# EAGLE design Mighty_GCD (EAGLE 6.3)
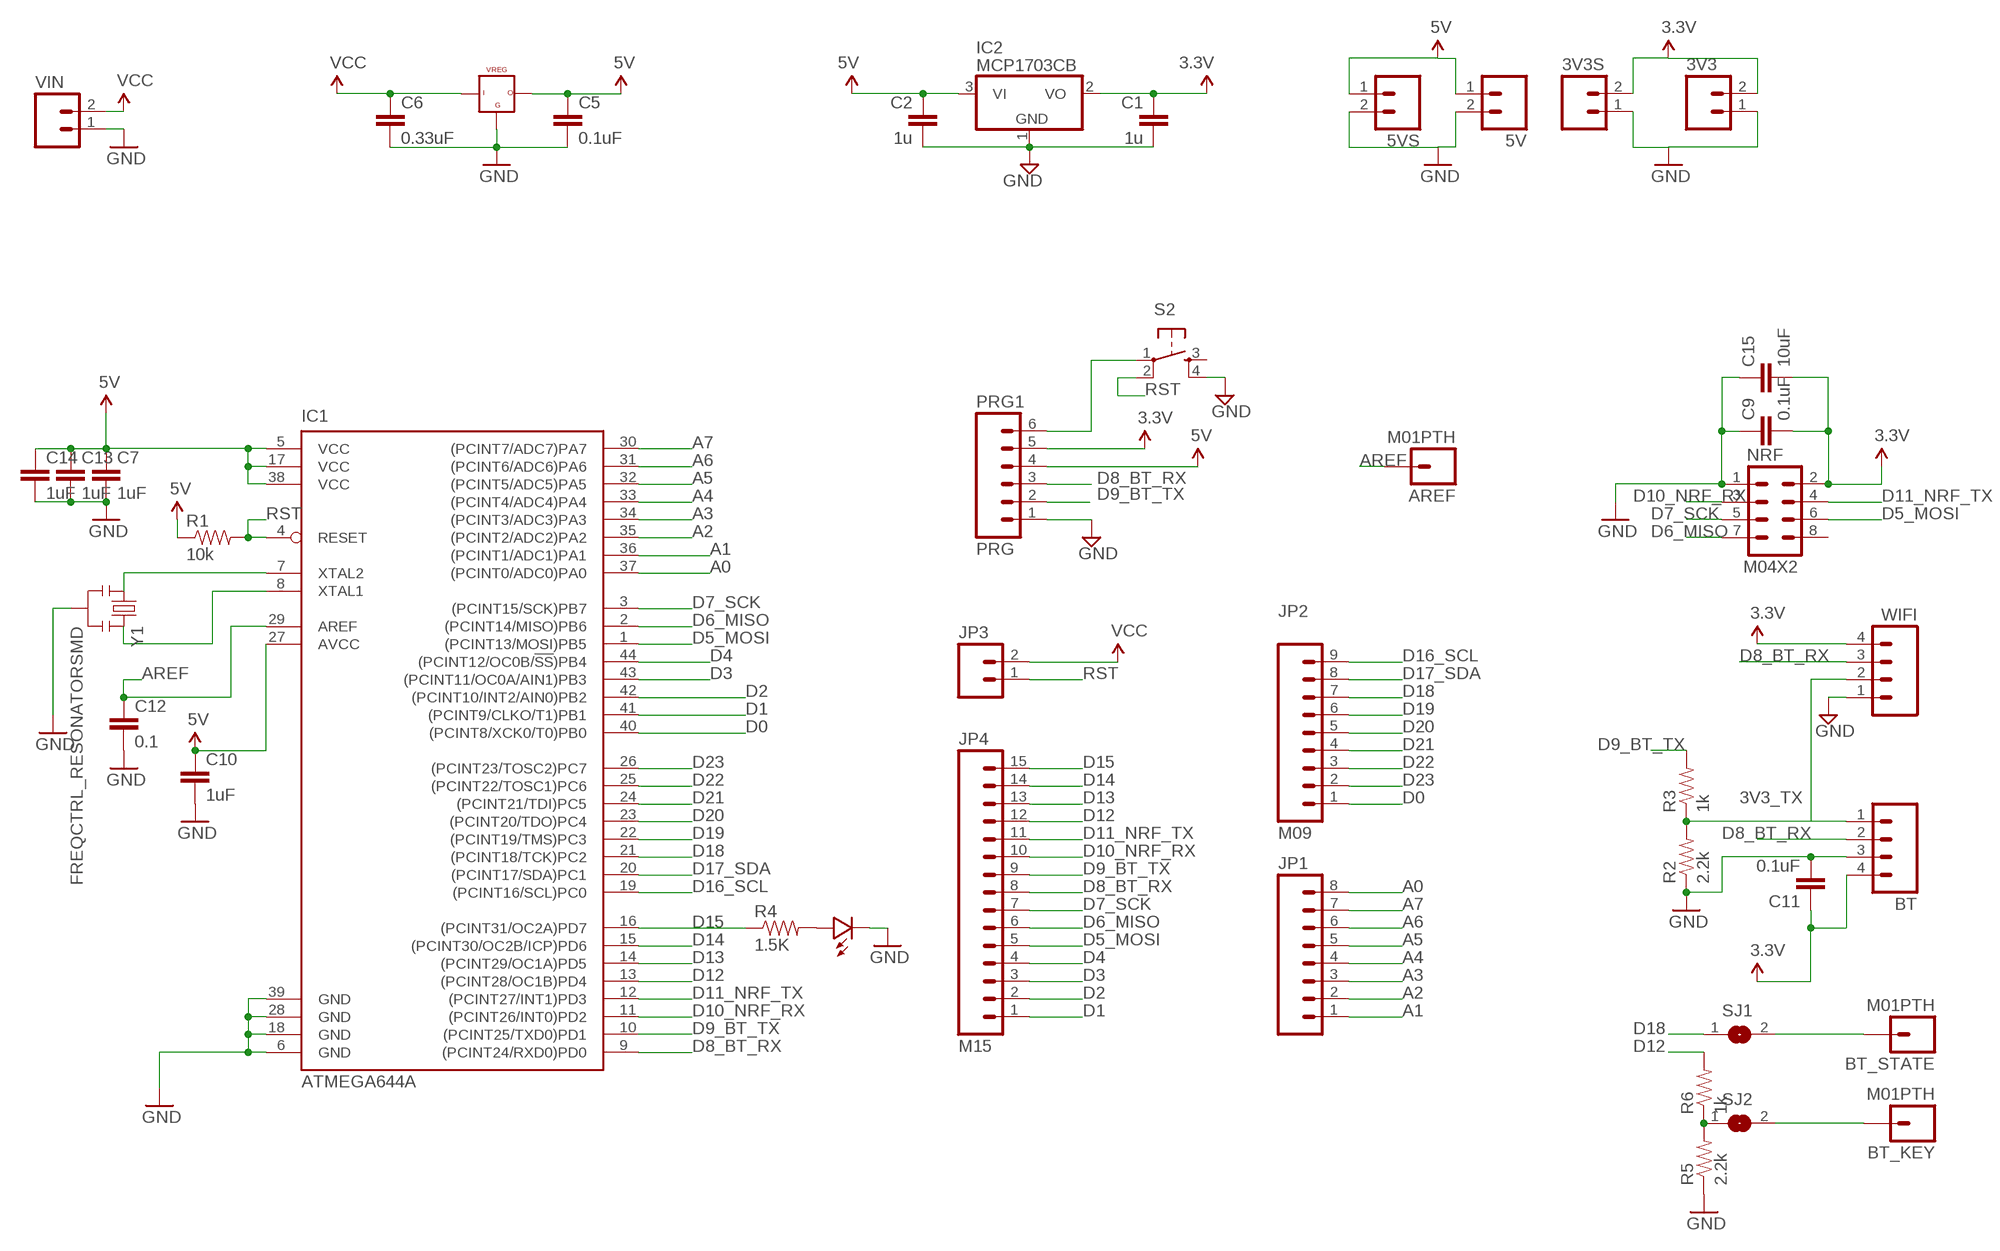
[diagram p0: schematic, sheet 1]

## Parts
3V3  M02PTH  [1X02]
3V3S  M02PTH  [1X02]
5V  M02PTH  [1X02]
5VS  M02PTH  [1X02]
AREF  M01PTH  [1X01]
BT  M04PTH  [1X04]
BT_KEY  M01PTH  [1X01]
BT_STATE  M01PTH  [1X01]
C1  1u  CAP0805  [0805]
C2  1u  CAP0805  [0805]
C5  0.1uF  CAP0805  [0805]
C6  0.33uF  CAP0805  [0805]
C7  1uF  CAP0805  [0805]
C9  0.1uF  CAP0805  [0805]
C10  1uF  CAP0805  [0805]
C11  0.1uF  CAP0805  [0805]
C12  0.1  CAP0805  [0805]
C13  1uF  CAP0805  [0805]
C14  1uF  CAP0805  [0805]
C15  10uF  CAP0805  [0805]
IC1  ATMEGA644A  [TQFP44]
IC2  MCP1703CB  [SOT23]
JP1  M081X08  [1X08]
JP2  M09  [1X09]
JP3  M02PTH  [1X02]
JP4  M15  [1X15]
NRF  M04X2  [2X4]
PRG1  PRG  M06SIP  [1X06]
R1  10k  RESISTOR0805-RES  [0805]
R2  2.2k  RESISTOR0805-RES  [0805]
R3  1k  RESISTOR0805-RES  [0805]
R4  1.5K  RESISTOR0805-RES  [0805]
R5  2.2k  RESISTOR0805-RES  [0805]
R6  1k  RESISTOR0805-RES  [0805]
S2  TAC_SWITCHSMD  [TACTILE_SWITCH_SMD]
SJ1  SJ  [SJ]
SJ2  SJ  [SJ]
U$5  VREG_5V  [DPACK]
U$14  LED0805  [0805-LED]
VIN  M02PTH  [1X02]
WIFI  M04PTH  [1X04]
Y1  FREQCTRL_RESONATORSMD  [FREQCTRL_RESONATOR-SMD]

## Nets
3.3V: 3V3.2 3V3S.2 BT.4 C1.1 C9.2 C11.1 C15.2 IC2.2(VO) NRF.2 PRG1.5 WIFI.4
3V3_TX: BT.1 R2.2 R3.1 WIFI.2
5V: 5V.1 5VS.1 C2.1 C5.1 C7.1 C10.1 C13.1 C14.1 IC1.5(VCC) IC1.17(VCC) IC1.27(AVCC) IC1.38(VCC) IC2.3(VI) PRG1.4 R1.1 U$5.3
A0: IC1.37((PCINT0/ADC0)PA0) JP1.8
A1: IC1.36((PCINT1/ADC1)PA1) JP1.1
A2: IC1.35((PCINT2/ADC2)PA2) JP1.2
A3: IC1.34((PCINT3/ADC3)PA3) JP1.3
A4: IC1.33((PCINT4/ADC4)PA4) JP1.4
A5: IC1.32((PCINT5/ADC5)PA5) JP1.5
A6: IC1.31((PCINT6/ADC6)PA6) JP1.6
A7: IC1.30((PCINT7/ADC7)PA7) JP1.7
AREF: AREF.1 C12.1 IC1.29(AREF)
D0: IC1.40((PCINT8/XCK0/T0)PB0) JP2.1
D1: IC1.41((PCINT9/CLKO/T1)PB1) JP4.1
D2: IC1.42((PCINT10/INT2/AIN0)PB2) JP4.2
D3: IC1.43((PCINT11/OC0A/AIN1)PB3) JP4.3
D4: IC1.44((PCINT12/OC0B/!SS!)PB4) JP4.4
D5_MOSI: IC1.1((PCINT13/MOSI)PB5) JP4.5 NRF.6
D6_MISO: IC1.2((PCINT14/MISO)PB6) JP4.6 NRF.7
D7_SCK: IC1.3((PCINT15/SCK)PB7) JP4.7 NRF.5
D8_BT_RX: BT.2 IC1.9((PCINT24/RXD0)PD0) JP4.8 PRG1.3 WIFI.3
D9_BT_TX: IC1.10((PCINT25/TXD0)PD1) JP4.9 PRG1.2 R3.2
D10_NRF_RX: IC1.11((PCINT26/INT0)PD2) JP4.10 NRF.3
D11_NRF_TX: IC1.12((PCINT27/INT1)PD3) JP4.11 NRF.4
D12: IC1.13((PCINT28/OC1B)PD4) JP4.12 R6.2
D13: IC1.14((PCINT29/OC1A)PD5) JP4.13
D14: IC1.15((PCINT30/OC2B/ICP)PD6) JP4.14
D15: IC1.16((PCINT31/OC2A)PD7) JP4.15 R4.1
D16_SCL: IC1.19((PCINT16/SCL)PC0) JP2.9
D17_SDA: IC1.20((PCINT17/SDA)PC1) JP2.8
D18: IC1.21((PCINT18/TCK)PC2) JP2.7 SJ1.1
D19: IC1.22((PCINT19/TMS)PC3) JP2.6
D20: IC1.23((PCINT20/TDO)PC4) JP2.5
D21: IC1.24((PCINT21/TDI)PC5) JP2.4
D22: IC1.25((PCINT22/TOSC1)PC6) JP2.3
D23: IC1.26((PCINT23/TOSC2)PC7) JP2.2
GND: 3V3.1 3V3S.1 5V.2 5VS.2 BT.3 C1.2 C2.2 C5.2 C6.2 C7.2 C9.1 C10.2 C11.2 C12.2 C13.2 C14.2 C15.1 IC1.6(GND) IC1.18(GND) IC1.28(GND) IC1.39(GND) IC2.1(GND) NRF.1 PRG1.1 R2.1 R5.1 S2.4 U$5.2 U$14.MINUS VIN.1 WIFI.1 Y1.2
N$1: R4.2 U$14.PLUS
N$2: IC1.7(XTAL2) Y1.1
N$3: IC1.8(XTAL1) Y1.3
N$4: PRG1.6 S2.1
N$5: BT_STATE.1 SJ1.2
N$6: BT_KEY.1 SJ2.2
N$7: R5.2 R6.1 SJ2.1
RST: IC1.4(RESET) JP3.1 R1.2 S2.2
VCC: C6.1 JP3.2 U$5.1 VIN.2
Unconnected: NRF.8 S2.3

## Library data of the parts
3V3 3V3S 5V 5VS JP3 VIN = SparkFun-Connectors:M02: Header 2 Standard 2-pin 0.1" header. Use with straight break away headers (SKU : PRT-00116), right angle break away headers (PRT-00553), swiss pins (PRT-00743), machine pins (PRT-00117), and female headers (PRT-00115). Molex polarized connector foot print use with SKU : PRT-08233 with associated crimp pins and housings.
AREF BT_KEY BT_STATE = SparkFun-Connectors:M01: Header 1 Standard 1-pin 0.1" header. Use with straight break away headers (SKU : PRT-00116), right angle break away headers (PRT-00553), swiss pins (PRT-00743), machine pins (PRT-00117), and female headers (PRT-00115).
BT WIFI = SparkFun-Connectors:M04: Header 4 Standard 4-pin 0.1" header. Use with straight break away headers (SKU : PRT-00116), right angle break away headers (PRT-00553), swiss pins (PRT-00743), machine pins (PRT-00117), and female headers (PRT-00115). Molex polarized connector foot print use with SKU : PRT-08231 with associated crimp pins and housings. 1MM SMD Version SKU: PRT-10208
C1 C2 C12 = LowPowerLab:CAP: Capacitor Standard 0603 ceramic capacitor, and 0.1" leaded capacitor.
C5-C7 C9-C11 C13-C15 = SparkFun-Capacitors:CAP: Capacitor Standard 0603 ceramic capacitor, and 0.1" leaded capacitor.
IC1 = atmel:ATMEGA644: 8-bit Microcontroller with 64K Bytes In-System Programmable Flash Source: http://www.atmel.com/dyn/resources/prod_documents/doc2593.pdf; MPN: ATMEGA644PV-10AU; OC_FARNELL: 1455123; OC_NEWARK: 58M3748
IC2 = linear:MCP1703: 250 mA, 16V, Low Quiescent Current LDO Regulator Source: http://ww1.microchip.com/downloads/en/DeviceDoc/22049b.pdf
JP1 = SparkFun-Connectors:M08: Header 8 Standard 8-pin 0.1" header. Use with straight break away headers (SKU : PRT-00116), right angle break away headers (PRT-00553), swiss pins (PRT-00743), machine pins (PRT-00117), and female headers (PRT-00115).
JP2 = SparkFun-Connectors:M09: Header 9 Standard 9-pin 0.1" header. Use with straight break away headers (SKU : PRT-00116), right angle break away headers (PRT-00553), swiss pins (PRT-00743), machine pins (PRT-00117), and female headers (PRT-00115).
JP4 = SparkFun-Connectors:M15: Header 15 Standard 15-pin 0.1" header. Use with straight break away headers (SKU : PRT-00116), right angle break away headers (PRT-00553), swiss pins (PRT-00743), machine pins (PRT-00117), and female headers (PRT-00115).
NRF = SparkFun-Connectors:M04X2: .1" header, two rows of four.
PRG1 = SparkFun-Connectors:M06: Header 6 Standard 6-pin 0.1" header. Use with straight break away headers (SKU : PRT-00116), right angle break away headers (PRT-00553), swiss pins (PRT-00743), machine pins (PRT-00117), and female headers (PRT-00115). Molex polarized connector foot print use with SKU : PRT-08094 with associated crimp pins and housings. NOTES ON THE VARIANTS LOCK and LOCK_LONGPADS... This footprint was designed to help hold the alignment of a through-hole component (i.e. 6-pin header) while soldering it into place. You may notice that each hole has been shifted either up or down by 0.005 of an inch from it's more standard position (which is a perfectly straight line). This slight alteration caused the pins (the squares in the middle) to touch the edges of the holes. Because they are alternating, it causes a "brace" to hold the component in place. 0.005 has proven to be the perfect amount of "off-center" position when using our standard breakaway headers. Although looks a little odd when you look at the bare footprint, once you have a header in there, the alteration is very hard to notice. Also, if you push a header all the way into place, it is covered up entirely on the bottom side. This idea of altering the position of holes to aid alignment will be further integrated into the Sparkfun Library for other footprints. It can help hold any component with 3 or more connection pins.
R1-R6 = SparkFun-Resistors:RESISTOR: Resistor Basic schematic elements and footprints for 0603, 1206, and PTH resistors.
S2 = SparkFun-Electromechanical:TAC_SWITCH: Momentary Switch Button commonly used for reset or general input. Spark Fun Electronics SKU : COM-00097 SMT- SWCH-08247; PROD_ID: SWCH-08247
SJ1 SJ2 = jumper:SJ: SMD solder JUMPER
U$5 = 11xSKIPS:VREG_5V
U$14 = LowPowerLab:LED
Y1 = 01_Skip_Tested:FREQCTRL_RESONATOR: Resonator Small SMD resonator. This is the itty bitty 10/20MHz resonators with built in caps. CSTCE10M0G55 and CSTCE20M0V53. Footprint has been reviewed closely but hasn t been tested yet.'

## Net classes
1 power: width 0.381 mm, clearance 0.254 mm

## Board
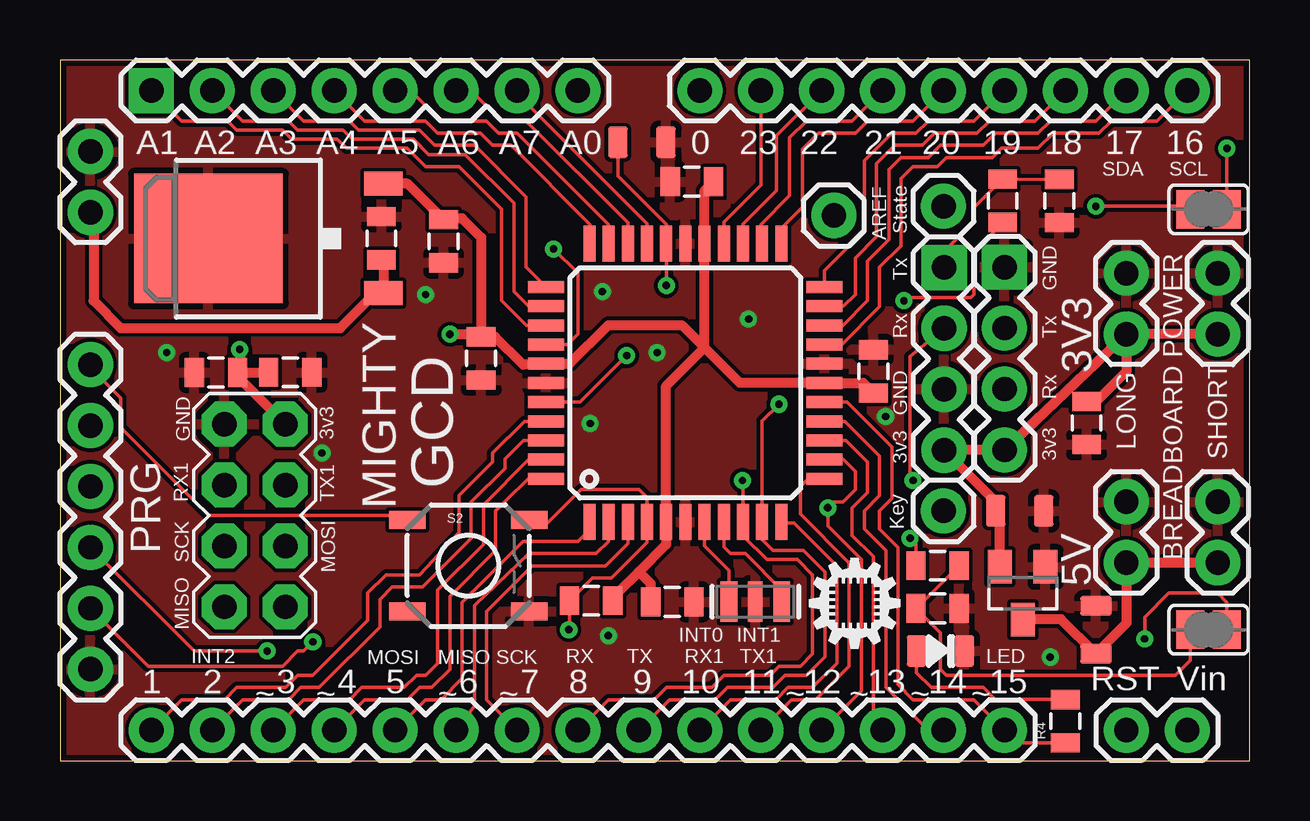
[diagram p1: board, top side]
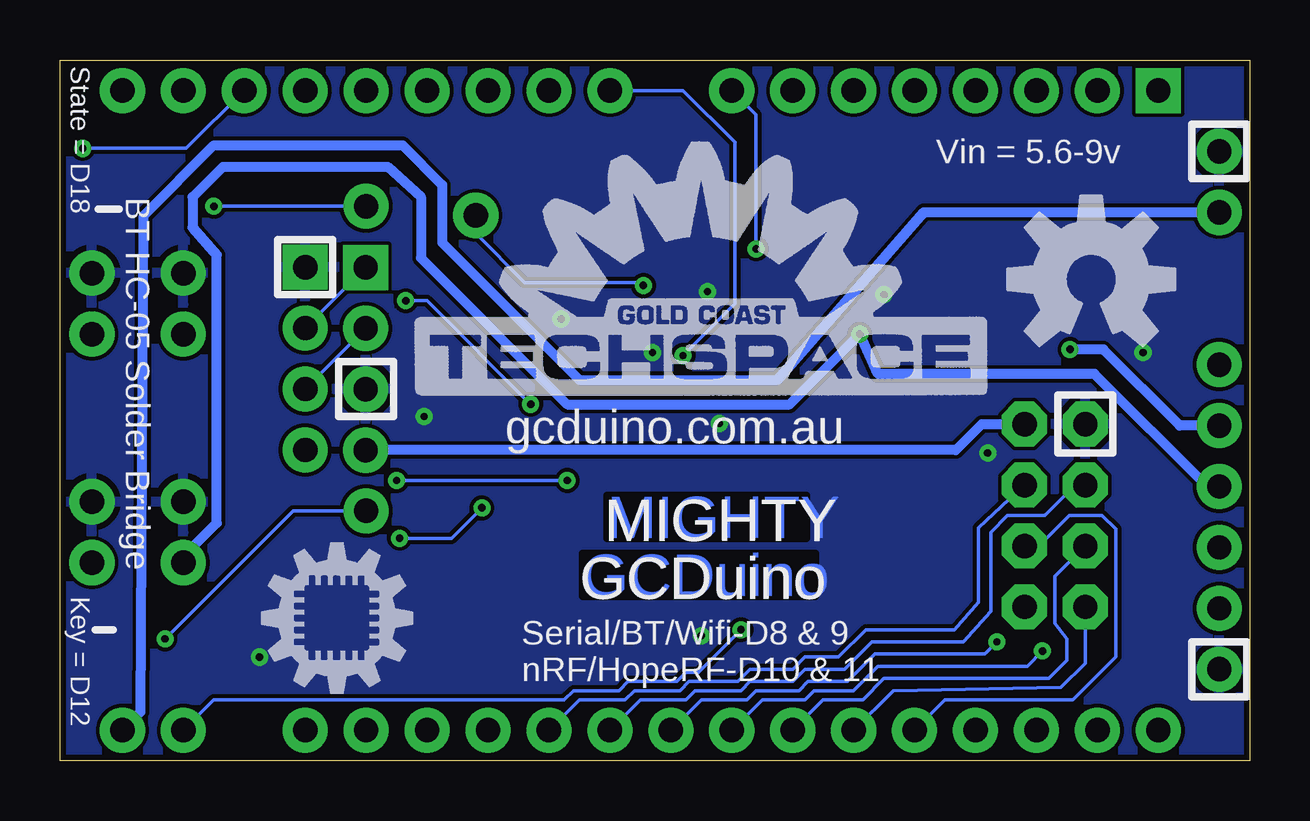
[diagram p2: board, bottom side, seen from below]

Size 49.59 x 29.21 mm. Coordinates in mm from the lower left corner, seen from the top.
Outline: 0,0 49.59,0 49.59,29.21 0,29.21 0,0
Copper layers (1*16): Top 0.035mm / dielectric 1.5mm / Bottom 0.035mm
Design rules "DFRobot_Eagle_Rule_v0.4": minimum track width 6mil, minimum drill 12mil, track to track 6mil, track to pad 6mil, pad to pad 6mil, via to via 6mil, smd to smd 0mil, copper to edge 10mil, drill to drill 10mil, minimum pad ring 12mil, minimum via ring 8mil, stop-mask expansion 2mil, vias tented up to drill 25mil, thermal gap 10mil

### Footprints (pad centres in the part's own frame; a part is rotated, then mirrored left to right if it is on the bottom)
1X02 = drill 1.016 pad 1.88: 1 0,0; 2 2.54,0
1X01 = drill 1.016 pad 1.88: 1 0,0
1X04 = drill 1.016 pad 1.88 square: 1 0,0 | drill 1.016 pad 1.88: 2 2.54,0; 3 5.08,0; 4 7.62,0
0805 = smd 0.8 x 1.3: 1 -1,0; 2 1,0
0805' = smd 0.8 x 1.2: 1 -0.9,0; 2 0.9,0
TQFP44 = smd 1.5 x 0.5: 1 -5.8,4; 2 -5.8,3.2; 3 -5.8,2.4; 4 -5.8,1.6; 5 -5.8,0.8; 6 -5.8,0; 7 -5.8,-0.8; 8 -5.8,-1.6; 9 -5.8,-2.4; 10 -5.8,-3.2; 11 -5.8,-4; 23 5.8,-4; 24 5.8,-3.2; 25 5.8,-2.4; 26 5.8,-1.6; 27 5.8,-0.8; 28 5.8,0; 29 5.8,0.8; 30 5.8,1.6; 31 5.8,2.4; 32 5.8,3.2; 33 5.8,4 | smd 0.5 x 1.5: 12 -4,-5.8; 13 -3.2,-5.8; 14 -2.4,-5.8; 15 -1.6,-5.8; 16 -0.8,-5.8; 17 0,-5.8; 18 0.8,-5.8; 19 1.6,-5.8; 20 2.4,-5.8; 21 3.2,-5.8; 22 4,-5.8; 34 4,5.8; 35 3.2,5.8; 36 2.4,5.8; 37 1.6,5.8; 38 0.8,5.8; 39 0,5.8; 40 -0.8,5.8; 41 -1.6,5.8; 42 -2.4,5.8; 43 -3.2,5.8; 44 -4,5.8
SOT23 = smd 1 x 1.4: 1 -0.95,-1.1; 2 0.95,-1.1; 3 0,1.1
1X08 = drill 1.016 pad 1.88 square: 1 0,0 | drill 1.016 pad 1.88: 2 2.54,0; 3 5.08,0; 4 7.62,0; 5 10.16,0; 6 12.7,0; 7 15.24,0; 8 17.78,0
1X09 = drill 1.016 pad 1.88: 1 0,0; 2 2.54,0; 3 5.08,0; 4 7.62,0; 5 10.16,0; 6 12.7,0; 7 15.24,0; 8 17.78,0; 9 20.32,0
1X15 = drill 1.016 pad 1.88: 1 0,0; 2 2.54,0; 3 5.08,0; 4 7.62,0; 5 10.16,0; 6 12.7,0; 7 15.24,0; 8 17.78,0; 9 20.32,0; 10 22.86,0; 11 25.4,0; 12 27.94,0; 13 30.48,0; 14 33.02,0; 15 35.56,0
2X4 = drill 1.016 pad 1.88 octagon: 1 -3.81,-1.27; 2 -3.81,1.27; 3 -1.27,-1.27; 4 -1.27,1.27; 5 1.27,-1.27; 6 1.27,1.27; 7 3.81,-1.27; 8 3.81,1.27
1X06 = drill 1.016 pad 1.88: 1 0,0; 2 2.54,0; 3 5.08,0; 4 7.62,0; 5 10.16,0; 6 12.7,0
TACTILE_SWITCH_SMD = smd 1.524 x 0.762: 1 -2.54,1.905; 2 2.54,1.905; 3 -2.54,-1.905; 4 2.54,-1.905
SJ = smd 1.168 x 1.6: 1 -0.762,0; 2 0.762,0
DPACK = smd 1 x 1.6: 1 -2.28,-4.8; 3 2.28,-4.8 | smd 5.4 x 6.2: 2 0,2.5
0805-LED = smd 0.8 x 1.3: MINUS -1,0; PLUS 1,0
FREQCTRL_RESONATOR-SMD = smd 0.7 x 1.7: 1 -1.1,0; 3 1.1,0 | smd 0.6 x 1.7: 2 0,0

### Placement (x,y rotation side)
3V3  48.26,20.32 270 top
3V3S  44.45,20.32 270 top
5V  48.26,8.26 90 top
5VS  44.45,8.26 90 top
AREF  32.26,22.73 0 top
BT  36.85,20.56 270 top
BT_KEY  36.83,10.41 0 top
BT_STATE  36.83,23.11 0 top
C1  40.01,10.41 0 top
C2  43.18,5.46 90 top
C5  0.1uF  [0805']  15.99,21.66 270 top
C6  0.33uF  [0805']  13.4,21.78 90 top
C7  1uF  [0805']  25.53,6.62 0 top
C9  0.1uF  [0805']  6.5,16.18 0 top
C10  1uF  [0805']  26.34,24.15 180 top
C11  0.1uF  [0805']  42.79,14.08 270 top
C12  24.26,25.78 0 top
C13  1uF  [0805']  33.9,16.23 90 top
C14  1uF  [0805']  17.56,16.77 270 top
C15  10uF  [0805']  9.6,16.19 180 top
IC1  26.07,15.75 90 top
IC2  40.13,6.99 180 top
JP1  3.81,27.94 0 top
JP2  26.67,27.94 0 top
JP3  44.45,1.27 0 top
JP4  3.81,1.27 0 top
NRF  8.12,10.22 270 top
PRG1  1.27,3.81 90 top
R1  10k  [0805']  22.14,6.67 180 top
R2  2.2k  [0805']  41.65,23.33 90 top
R3  1k  [0805']  39.29,23.34 270 top
R4  1.5K  [0805']  41.91,1.65 90 top
R5  2.2k  [0805']  36.58,6.35 180 top
R6  1k  [0805']  36.58,8.13 180 top
S2  17.02,8.13 0 top
SJ1  47.88,22.99 180 top
SJ2  47.88,5.46 0 top
U$1  [ID_LOGO_X0.25]  41.27,2.67 0 bottom
U$2  [GCTS_X0.5_TSILK]  34.8,15.11 0 bottom
U$3  [OSHW-LOGO-L]  6.6,20.07 0 bottom
U$4  [ID_LOGO_X0.15]  33.07,6.58 0 top
U$5  8.69,21.77 90 top
U$14  36.7,4.57 180 top
VIN  1.27,25.4 270 top
WIFI  39.37,20.57 270 top
Y1  28.98,6.63 0 top

### Tracks (layer width: path | path; a pad name or v marks a point on that pad's centre or on a via)
3.3V  (via drill 0.3)
  Top 0.406: 3V3.2 3V3S.2 | C9.2 8.56,16.18 C15.2 | NRF.2 7.4,16.02 C9.2 | v7.49,17.14 7.53,16.42 C9.2 | 3V3S.2 44.45,16.22 43.2,14.98 C11.1 | 3V3S.2 WIFI.4 36.86,12.95 BT.4 39.01,10.79 C1.1 39.18,10.24 IC2.2
  Bottom 0.406: PRG1.5 2.92,13.97 6.1,17.14 v7.49,17.14 | BT.4 12.26,12.94 11.17,14.03 NRF.2
3V3_TX
  Top 0.152: BT.1 36.85,21.23 38.1,22.48 38.1,23.05 R3.1 39.68,24.24 R2.2
  Bottom 0.152: BT.1 38.1,19.32 38.1,19.3 WIFI.2
5V  (via drill 0.3)
  Top 0.406: 26.87,17.21 25.27,15.62 IC1.5 25.27,9.01 24.13,7.87 | 26.87,17.21 IC1.27 26.87,23.78 C10.1 | 26.87,17.21 28.33,15.75 IC1.17 33.49,15.75 C13.1 | 24.13,7.87 23.24,6.99 23.24,6.87 R1.1 | C7.1 24.63,7.38 24.13,7.87 | 5V.1 5VS.1 44.45,5.73 C2.1 41.73,5.9 IC2.3 | U$5.3 14.5,24.05 C5.1 16.04,22.61 16.76,22.61 17.56,21.81 C14.1 | v16.26,17.78 17.45,17.78 C14.1 | 26.87,17.21 25.92,18.16 22.86,18.16 21.25,16.55 IC1.38 20.23,16.51 19.3,16.51 18.14,17.67 C14.1
  Bottom 0.406: PRG1.4 1.78,11.43 6.48,16.13 15.49,16.13 v16.26,17.78 19.18,14.86 28.45,14.86 34.54,20.95 34.54,23.5 35.94,24.77 42.8,24.77 44.07,23.5 44.07,22.23 43.05,21.08 43.05,9.91 44.45,8.51 5VS.1
A0  (via drill 0.3)
  Top 0.152: IC1.37 21.16,17.35 21.59,17.78 21.59,20.32 v20.57,21.34
  Bottom 0.152: v20.57,21.34 20.57,26.92 JP1.8
A1
  Top 0.152: JP1.1 5.08,26.67 6.99,26.67 7.37,26.29 9.27,26.29 9.65,25.91 11.56,25.91 11.94,25.53 14.48,25.53 15.24,24.77 16.64,24.77 18.41,22.99 18.41,19.18 19.44,18.15 IC1.36
A2
  Top 0.152: JP1.2 7.62,26.67 9.53,26.67 9.91,26.29 11.81,26.29 12.19,25.91 14.73,25.91 15.37,25.27 16.89,25.27 18.92,23.24 18.92,19.56 19.53,18.95 IC1.35
A3
  Top 0.152: JP1.3 10.16,26.67 12.06,26.67 12.45,26.29 14.99,26.29 15.62,25.65 17.27,25.65 19.43,23.5 19.43,20.58 IC1.34
A4
  Top 0.152: JP1.4 12.7,26.67 15.24,26.67 15.75,26.16 17.53,26.16 18.03,25.65 18.8,25.65 22.1,22.35 22.1,21.58 IC1.33
A5
  Top 0.152: IC1.32 22.87,22.34 19.05,26.16 18.29,26.16 17.78,26.67 15.88,26.67 14.61,27.94 JP1.5
A6
  Top 0.152: IC1.31 23.67,22.43 19.43,26.67 18.41,26.67 17.14,27.94 JP1.6
A7
  Top 0.152: IC1.30 24.47,22.4 19.05,27.81 JP1.7
AREF  (via drill 0.3)
  Top 0.152: v25.27,19.81 IC1.29 25.27,22.35 23.26,24.37 C12.1
  Bottom 0.152: AREF.1 32.26,21.97 30.23,19.94 25.4,19.94 v25.27,19.81
D0  (via drill 0.3)
  Top 0.152: IC1.40 21.68,14.95 v23.62,16.89
  Bottom 0.152: v23.62,16.89 21.46,19.05 21.46,25.78 23.62,27.94 JP2.1
D1
  Top 0.152: IC1.41 19.36,14.15 18.03,12.83 18.03,12.45 16.64,11.05 16.64,9.53 14.99,7.75 13.59,7.75 12.83,6.99 12.83,5.84 10.54,3.56 9.91,3.56 9.4,3.05 7.37,3.05 6.86,2.54 5.08,2.54 JP4.1
D2
  Top 0.152: IC1.42 19.32,13.35 18.54,12.57 18.54,12.19 17.14,10.79 17.14,9.27 15.11,7.24 13.84,7.24 13.34,6.73 13.34,5.59 10.79,3.05 10.03,3.05 9.53,2.54 7.62,2.54 JP4.2
D3
  Top 0.152: IC1.43 19.53,12.55 17.65,10.67 17.65,9.02 15.75,7.11 15.75,4.06 15.24,3.56 14.86,3.56 14.35,3.05 12.57,3.05 12.06,2.54 10.16,2.54 JP4.3
D4
  Top 0.152: JP4.4 12.7,2.54 14.48,2.54 14.99,3.05 15.49,3.05 16.26,3.81 16.26,6.86 18.16,8.76 18.16,10.41 18.67,10.92 19.44,11.68 19.5,11.75 IC1.44
D5_MOSI
  Top 0.152: IC1.1 22.07,9.62 21.59,9.14 19.3,9.14 16.76,6.6 16.76,3.43 15.88,2.54 15.24,2.54 JP4.5
  Bottom 0.152: 9.34,8.95 NRF.6 8.79,8.95 7.52,10.22 6.16,10.22 5.59,9.65 5.59,4.32 7.37,2.54 12.7,2.54 JP4.5
D6_MISO
  Top 0.152: IC1.2 22.87,9.15 22.35,8.64 19.56,8.64 17.27,6.48 17.27,2.29 JP4.6
  Bottom 0.152: JP4.6 14.86,2.92 7.87,3.05 6.86,4.06 NRF.7
D7_SCK
  Top 0.152: IC1.3 23.67,9.06 22.73,8.13 19.68,8.13 17.78,6.22 17.78,2.54 JP4.7
  Bottom 0.152: NRF.5 8.13,7.67 8.13,5.71 7.62,5.08 7.62,4.19 8.38,3.43 15.24,3.43 16.13,2.54 17.78,2.54 JP4.7
D8_BT_RX  (via drill 0.3)
  Top 0.152: JP4.8 22.86,2.54 24.77,2.54 25.27,3.05 27.18,3.05 27.69,3.56 29.59,3.56 29.97,3.94 30.86,3.94 31.37,4.45 31.37,7.75 30.73,8.38 29.46,8.38 28.47,9.38 IC1.9 28.47,11.66 v28.45,11.68 | v8.64,4.57 5.59,4.57 PRG1.3 | BT.2 35.43,16.86 35.43,11.81 v35.56,11.68
  Bottom 0.152: JP4.8 20.32,2.54 18.54,2.54 18.16,2.92 16.51,2.92 15.49,3.94 9.27,3.94 v8.64,4.57 | v35.56,11.68 v28.45,11.68 | BT.2 WIFI.3
D9_BT_TX  (via drill 0.3)
  Top 0.152: JP4.9 25.4,2.54 27.3,2.54 27.81,3.05 29.72,3.05 30.23,3.56 31.11,3.56 31.88,4.32 31.88,7.87 30.99,8.76 29.72,8.76 29.27,9.21 IC1.10 29.27,14.15 v29.97,14.86 | v10.54,4.95 10.16,4.57 9.91,4.57 9.27,3.94 3.68,3.94 PRG1.2 | R3.2 39.29,22.4 38.1,21.21 38.1,19.43 37.97,19.3 35.31,19.3 v35.18,19.18
  Bottom 0.152: JP4.9 22.86,2.54 20.95,2.54 20.57,2.92 18.8,2.92 18.41,3.3 16.76,3.3 15.62,4.45 11.05,4.45 v10.54,4.95 | v35.18,19.18 34.29,19.18 v29.97,14.86
D10_NRF_RX
  Top 0.152: JP4.10 27.94,2.54 29.84,2.54 30.35,3.05 31.37,3.05 32.38,4.06 32.38,8.13 30.6,9.92 30.1,9.92 IC1.11
  Bottom 0.152: NRF.3 7.27,11.49 8.54,10.22 10.1,10.22 10.79,9.53 10.79,6.22 11.94,4.95 15.75,4.95 16.89,3.81 18.54,3.81 19.05,3.3 20.83,3.3 21.21,2.92 23.11,2.92 23.5,2.54 25.4,2.54 JP4.10
D11_NRF_TX
  Top 0.152: JP4.11 30.48,2.54 31.5,2.54 32.89,3.94 32.89,8.26 30.86,10.29 30.86,11.43 31.11,11.68 31.8,11.68 IC1.12
  Bottom 0.152: JP4.11 27.94,2.54 26.04,2.54 25.65,2.92 23.75,2.92 23.37,3.3 21.34,3.3 20.83,3.81 19.05,3.81 18.54,4.32 17.14,4.32 16,5.46 12.32,5.46 11.3,6.6 11.3,9.71 NRF.4
D12  (via drill 0.3)
  Top 0.152: IC1.13 32.66,12.55 33.15,12.06 33.15,11.3 32.64,10.79 32.26,10.79 v32,10.54 32,9.78 33.4,8.38 33.4,2.92 JP4.12 | v35.43,9.27 35.68,9.03 R6.2
  Bottom 0.152: v32,10.54 33.27,9.27 v35.43,9.27
D13
  Top 0.152: IC1.14 32.75,13.35 33.66,12.45 33.66,11.18 33.02,10.54 33.02,9.4 33.91,8.51 33.91,1.65 JP4.13
D14
  Top 0.152: IC1.15 32.72,14.15 34.16,12.7 34.16,11.05 33.53,10.41 33.53,9.65 34.42,8.76 34.42,3.05 36.2,1.27 JP4.14
D15
  Top 0.152: IC1.16 32.8,14.95 34.67,13.08 34.67,10.92 34.16,10.41 34.16,9.65 34.92,8.89 34.92,3.17 35.56,2.54 38.1,2.54 JP4.15 39.89,0.75 R4.1
D16_SCL
  Top 0.152: IC1.19 32.59,17.35 34.16,18.92 34.16,20.57 35.05,21.46 35.05,24.26 35.56,24.77 36.58,24.77 36.96,25.15 38.86,25.15 39.24,25.53 40.77,25.53 41.4,26.16 43.31,26.16 43.81,26.67 45.72,26.67 JP2.9
D17_SDA
  Top 0.152: IC1.20 32.63,18.15 33.66,19.18 33.66,20.83 34.54,21.72 34.54,24.64 35.05,25.15 36.2,25.15 36.7,25.65 38.48,25.65 38.99,26.16 40.77,26.16 41.27,26.67 43.18,26.67 JP2.8
D18  (via drill 0.3)
  Top 0.152: IC1.21 32.66,18.95 33.15,19.43 33.15,20.95 34.04,21.84 34.04,24.89 34.8,25.65 35.94,25.65 36.45,26.16 38.23,26.16 38.73,26.67 40.64,26.67 JP2.7 | v48.64,25.53 SJ1.1
  Bottom 0.152: JP2.7 44.32,25.53 v48.64,25.53
D19
  Top 0.152: IC1.22 31.87,20.44 33.53,22.1 33.53,25.02 34.67,26.16 35.69,26.16 36.2,26.67 38.1,26.67 JP2.6
D20
  Top 0.152: JP2.5 35.56,26.67 33.66,26.67 33.15,26.16 31.62,26.16 30.96,25.5 30.96,23.08 30.1,22.23 30.1,21.58 IC1.23
D21
  Top 0.152: JP2.4 33.02,26.67 31.11,26.67 30.41,25.96 30.41,23.55 29.21,22.35 29.21,21.61 IC1.24
D22
  Top 0.152: JP2.3 29.86,26.05 29.86,23.77 28.47,22.37 IC1.25
D23
  Top 0.152: 29.08,27.81 JP2.2 29.21,24 27.67,22.46 IC1.26
GND  (via drill 0.3)
  other vias: 15.24,19.43 22.86,5.21 4.45,17.02 10.92,12.83 22.1,14.06 24.89,17.02 22.61,19.56 28.7,18.41 41.27,4.32 34.42,14.35
  pour Top (isolate 0.16): 0,0 49.53,0 49.53,29.21 0,29.21
  pour Bottom (isolate 0.16): 0,0 49.53,0 49.53,29.21 0,29.21
N$1
  Top 0.152: R4.2 38.98,2.55 38.48,3.05 36.32,3.05 35.7,3.67 U$14.PLUS
N$2
  Top 0.152: Y1.1 27.88,7.93 26.87,8.95 IC1.7
N$3
  Top 0.152: IC1.8 27.67,8.91 27.94,8.64 28.57,8.64 30.08,7.13 Y1.3
N$4
  Top 0.152: S2.1 14.28,10.23 6.21,10.23 2.54,13.89 2.54,15.11 1.27,16.38 PRG1.6
N$5  (via drill 0.3)
  Top 0.152: v43.18,23.11 46.99,23.11 SJ1.2
  Bottom 0.152: BT_STATE.1 v43.18,23.11
N$6  (via drill 0.3)
  Top 0.152: v45.21,5.08 45.21,5.97 46.23,6.99 48.26,6.99 48.64,6.6 SJ2.2
  Bottom 0.152: BT_KEY.1 39.88,10.41 v45.21,5.08
N$7
  Top 0.152: R6.1 35.7,6.35 R5.2 36.7,5.32 36.7,3.81 36.96,3.56 46.48,3.56 47.12,4.19 SJ2.1
RST  (via drill 0.3)
  Top 0.152: S2.2 20.32,9.91 21.72,11.3 24.13,11.3 24.47,10.97 IC1.4 24.47,9.1 22.99,7.62 22.19,7.62 R1.2 21.24,5.49 v21.21,5.46
  Bottom 0.152: JP3.1 43.18,2.54 28.57,2.54 28.19,2.92 26.29,2.92 25.91,3.3 23.88,3.3 23.5,3.68 22.99,3.68 v21.21,5.46
VCC
  Top 0.406: VIN.2 1.4,22.73 1.4,19.18 2.54,18.03 11.68,18.03 13.14,19.49 U$5.1 13.49,20.79 C6.1
  Bottom 0.406: JP3.2 46.23,2.03 46.1,22.73 43.18,25.65 35.31,25.65 33.66,24 33.66,21.59 27.94,15.88 19.68,15.88 13.59,22.86 VIN.2

### Text on the board
Bottom: MIGHTY | GCDuino
tPlace: A1 | A2 | A3 | A4 | A5 | A6 | A7 | A0 | 0 | 23 | 22 | 21 | 20 | 19 | 18 | 17 | 16 | SDA | SCL | State | GND | Tx | MIGHTY | Rx | Tx | GCD | GND | Rx | 3v3 | 3v3 | GND | 3v3 | LONG | SHORT | RX1 | TX1 | SCK | MOSI | Key | BREADBOARD POWER | MISO | MOSI | SCK | INT0 | INT1 | INT2 | MISO | RX | TX | RX1 | TX1 | LED | RST | Vin | 1 | 2 | 3 | 4 | 5 | 6 | 7 | 8 | 9 | 10 | 11 | 12 | 13 | 14 | 15 | ~ | ~ | ~ | ~ | ~ | ~ | ~ | ~
bPlace: State = D18 | Vin = 5.6-9v | BT HC-05 Solder Bridge | gcduino.com.au | MIGHTY | GCDuino | Key = D12 | Serial/BT/Wifi-D8 & 9 | nRF/HopeRF-D10 & 11
Reference: - | +